# EAGLE design UnicersalRackcard (EAGLE 6.5.0)
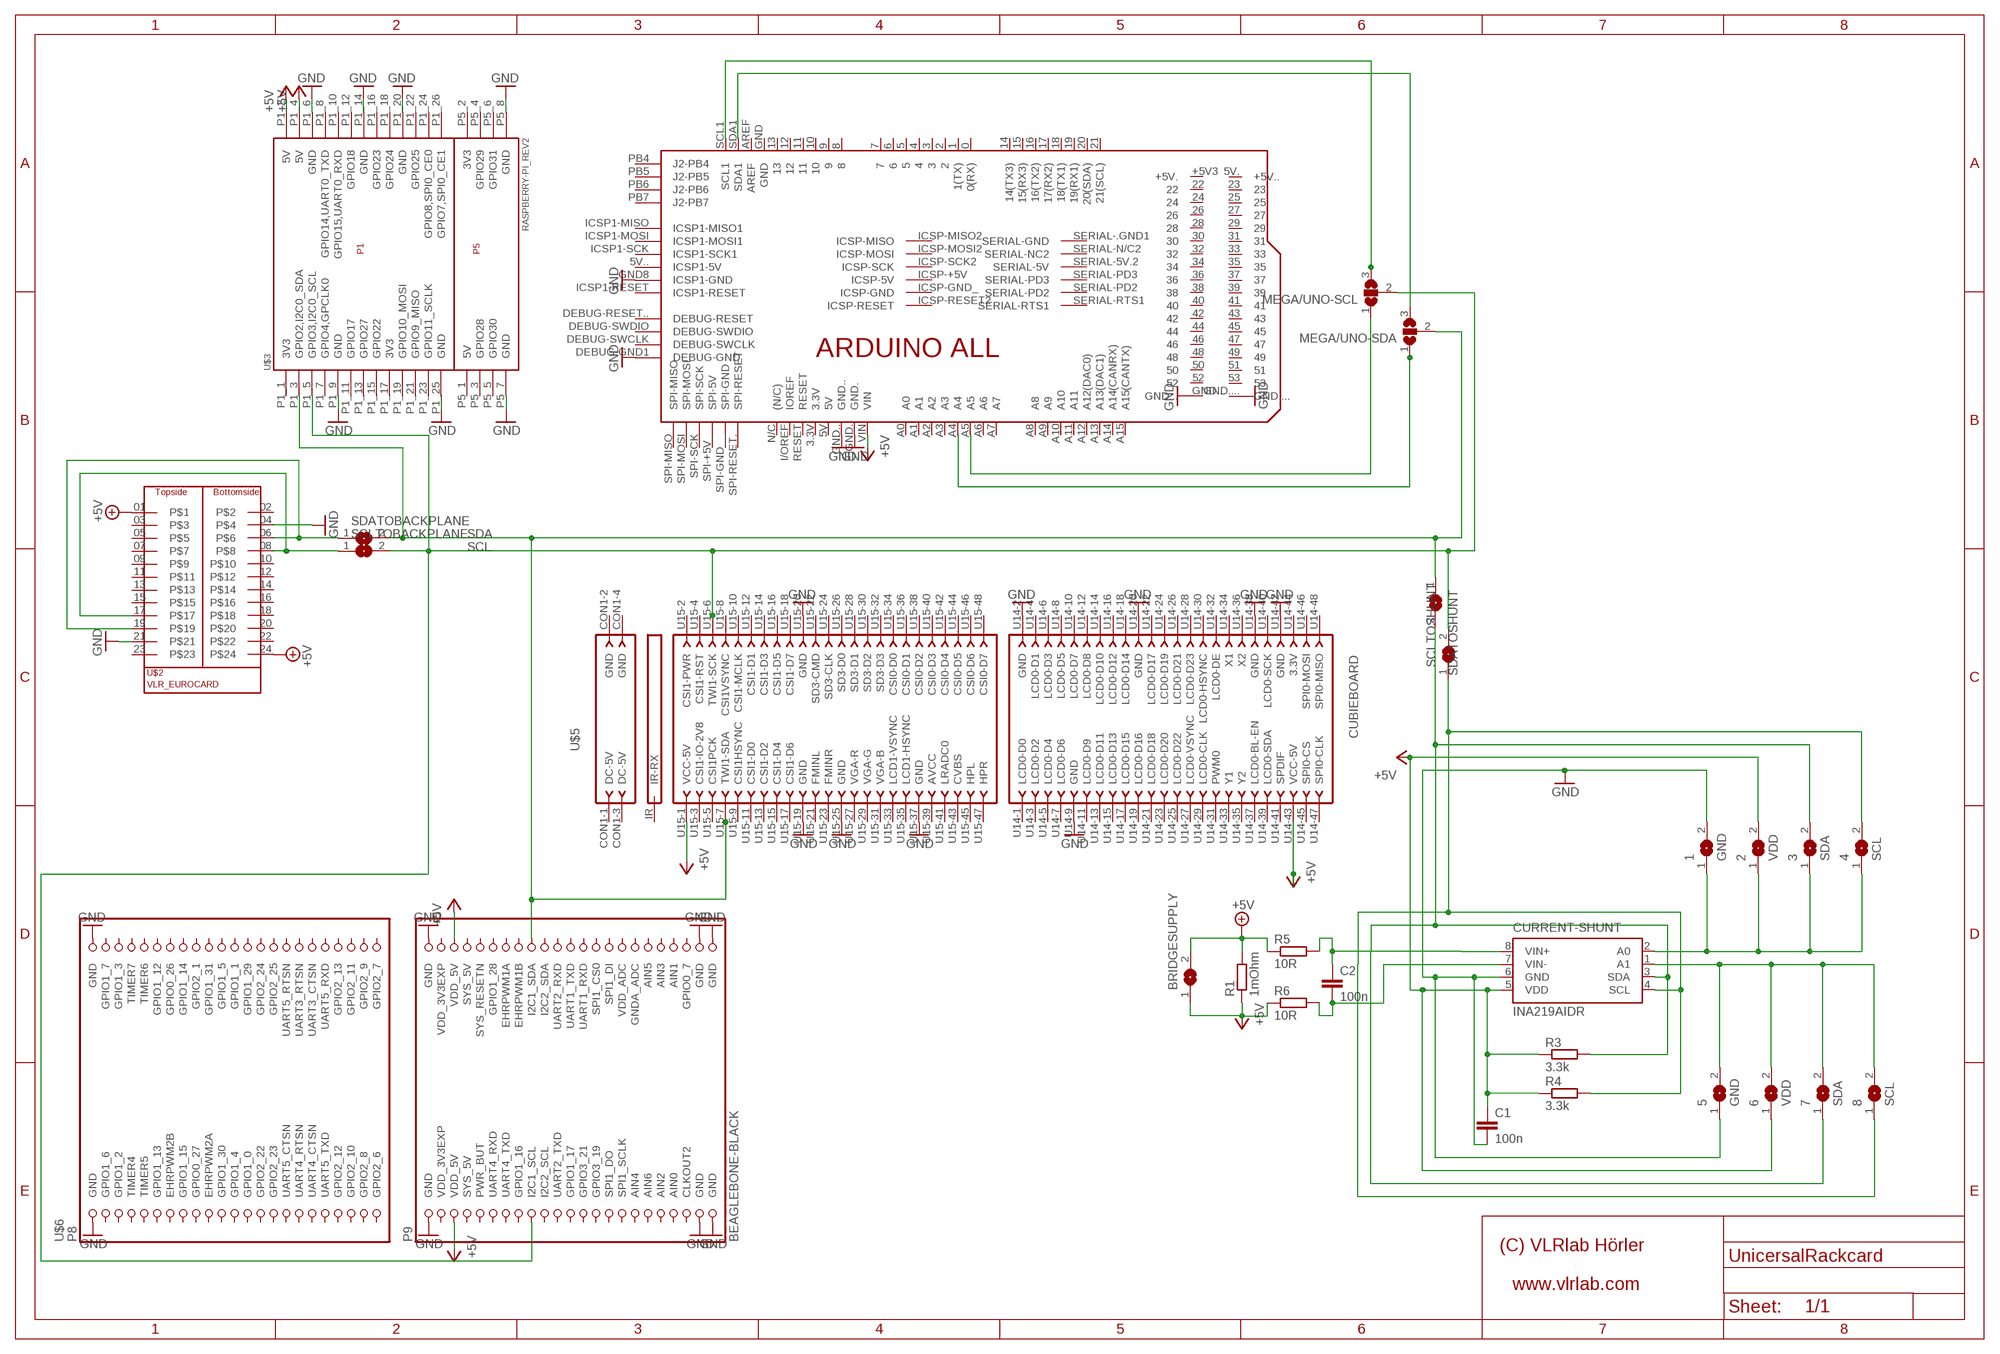
[diagram p0: schematic, sheet 1]

## Parts
1  GND  SJ  [SJ]
2  VDD  SJ  [SJ]
3  SDA  SJ  [SJ]
4  SCL  SJ  [SJ]
5  GND  SJ  [SJ]
6  VDD  SJ  [SJ]
7  SDA  SJ  [SJ]
8  SCL  SJ  [SJ]
BRIDGESUPPLY  SJW  [SJW]
C1  100n  C-EU025-024X044  [C025-024X044]
C2  100n  C-EU025-024X044  [C025-024X044]
CURRENT-SHUNT  INA219AIDR  [SO-08]
MEGA/UNO-SCL  SJ2W  [SJ_2]
MEGA/UNO-SDA  SJ2W  [SJ_2]
R1  1mOhm  R-EU_R2512  [R2512]
R3  3.3k  R-EU_0207/7  [0207/7]
R4  3.3k  R-EU_0207/7  [0207/7]
R5  10R  R-EU_0207/7  [0207/7]
R6  10R  R-EU_0207/7  [0207/7]
SCLTOBACKPLANE  SJ  [SJ]
SCLTOSHUNT  SJ  [SJ]
SDATOBACKPLANE  SJ  [SJ]
SDATOSHUNT  SJ  [SJ]
U$2  VLR_EUROCARD  [VLR_EUROCARD]
U$3  RASPBERRY-PI_REV2  [RASPBERRY-PI_REV2]
U$4  ARDUINO_ALL  [ALL]
U$5  CUBIEBOARD  [CUBIEBOARD]
U$6  BEAGLEBONE-BLACK  [BEAGLEBONE]

## Nets
+5V: 2.2 6.1 BRIDGESUPPLY.1 C1.1 CURRENT-SHUNT.5(VDD) R1.1 R3.1 R4.1 R6.1 U$3.P1_2(5V) U$3.P1_4(5V) U$4.VIN U$5.U14-43(VCC-5V) U$5.U15-1(VCC-5V) U$6.51(VDD_5V) U$6.52(VDD_5V)
A0: 1.1 2.1 3.1 4.1 CURRENT-SHUNT.2(A0)
A1: 5.2 6.2 7.2 8.2 CURRENT-SHUNT.1(A1)
GND: 1.2 5.1 C1.2 CURRENT-SHUNT.6(GND) U$2.04 U$2.21 U$3.P1_6(GND) U$3.P1_9(GND) U$3.P1_14(GND) U$3.P1_20(GND) U$3.P1_25(GND) U$3.P5_7(GND) U$3.P5_8(GND) U$4.DEBUG-GND1(DEBUG-GND) U$4.GND8(ICSP1-GND) U$4.GND. U$4.GND.. U$5.U14-2(GND) U$5.U14-9(GND) U$5.U14-20(GND) U$5.U14-38(GND) U$5.U14-42(GND) U$5.U15-19(GND) U$5.U15-20(GND) U$5.U15-25(GND) U$5.U15-37(GND) U$6.47(GND) U$6.48(GND) U$6.89(GND) U$6.90(GND) U$6.91(GND) U$6.92(GND) U$6.P8-1(GND) U$6.P8-2(GND)
N$1: MEGA/UNO-SDA.1 U$4.A4
N$2: MEGA/UNO-SCL.1 U$4.A5
N$3: MEGA/UNO-SCL.3 U$4.SCL1
N$4: MEGA/UNO-SDA.3 U$4.SDA1
N$5: 3.2 7.1 CURRENT-SHUNT.3(SDA) R3.2 SDATOSHUNT.2
N$6: 4.2 8.1 CURRENT-SHUNT.4(SCL) R4.2 SCLTOSHUNT.1
N$11: SDATOBACKPLANE.1 U$2.06 U$2.19
N$12: SCLTOBACKPLANE.1 U$2.08 U$2.17
PRIM+5V: BRIDGESUPPLY.2 R1.2 R5.1 U$2.01 U$2.24 ; supply symbol labelled +5V
SCL: MEGA/UNO-SCL.2 SCLTOBACKPLANE.2 SCLTOSHUNT.2 U$3.P1_5(GPIO3,I2C0_SCL) U$5.U15-6(TWI1-SCK) U$6.63(I2C1_SCL)
SDA: MEGA/UNO-SDA.2 SDATOBACKPLANE.2 SDATOSHUNT.1 U$3.P1_3(GPIO2,I2C0_SDA) U$5.U15-7(TWI1-SDA) U$6.64(I2C1_SDA)
VIN+: C2.1 CURRENT-SHUNT.8(VIN+) R5.2
VIN-: C2.2 CURRENT-SHUNT.7(VIN-) R6.2
Unconnected: U$2.02 U$2.03 U$2.05 U$2.07 U$2.09 U$2.10 U$2.11 U$2.12 U$2.13 U$2.14 U$2.15 U$2.16 U$2.18 U$2.20 U$2.22 U$2.23 U$3.P1_1(3V3) U$3.P1_7(GPIO4,GPCLK0) U$3.P1_8(GPIO14,UART0_TXD) U$3.P1_10(GPIO15,UART0_RXD) U$3.P1_11(GPIO17) U$3.P1_12(GPIO18) U$3.P1_13(GPIO27) U$3.P1_15(GPIO22) U$3.P1_16(GPIO23) U$3.P1_17(3V3) U$3.P1_18(GPIO24) U$3.P1_19(GPIO10_MOSI) U$3.P1_21(GPIO9_MISO) U$3.P1_22(GPIO25) U$3.P1_23(GPIO11_SCLK) U$3.P1_24(GPIO8,SPI0_CE0) U$3.P1_26(GPIO7,SPI0_CE1) U$3.P5_1(5V) U$3.P5_2(3V3) U$3.P5_3(GPIO28) U$3.P5_4(GPIO29) U$3.P5_5(GPIO30) U$3.P5_6(GPIO31) U$4.0(0(RX)) U$4.1(1(TX)) U$4.2 U$4.3 U$4.3.3V U$4.4 U$4.5 U$4.5V U$4.5V.(+5V..) U$4.5V..(ICSP1-5V) U$4.6 U$4.7 U$4.8 U$4.9 U$4.10 U$4.11 U$4.12 U$4.13 U$4.14(14(TX3)) U$4.15(15(RX3)) U$4.16(16(TX2)) U$4.17(17(RX2)) U$4.18(18(TX1)) U$4.19(19(RX1)) U$4.20(20(SDA)) U$4.21(21(SCL)) U$4.22 U$4.23 U$4.24 U$4.25 U$4.26 U$4.27 U$4.28 U$4.29 U$4.30 U$4.31 U$4.32 U$4.33 U$4.34 U$4.35 U$4.36 U$4.37 U$4.38 U$4.39 U$4.40 U$4.41 U$4.42 U$4.43 U$4.44 U$4.45 U$4.46 U$4.47 U$4.48 U$4.49 U$4.50 U$4.51 U$4.52 U$4.53 U$4.+5V3(+5V.) U$4.A0 U$4.A1 U$4.A2 U$4.A3 U$4.A6 U$4.A7 U$4.A8 U$4.A9 U$4.A10 U$4.A11 U$4.A12(A12(DAC0)) U$4.A13(A13(DAC1)) U$4.A14(A14(CANRX)) U$4.A15(A15(CANTX)) U$4.AREF U$4.DEBUG-RESET..(DEBUG-RESET) U$4.DEBUG-SWCLK U$4.DEBUG-SWDIO U$4.GND U$4.GND... U$4.GND.... U$4.I/OREF(IOREF) U$4.ICSP1-MISO(ICSP1-MISO1) U$4.ICSP1-MOSI(ICSP1-MOSI1) U$4.ICSP1-RESET U$4.ICSP1-SCK(ICSP1-SCK1) U$4.ICSP-+5V(ICSP-5V) U$4.ICSP-GND_(ICSP-GND) U$4.ICSP-MISO2(ICSP-MISO) U$4.ICSP-MOSI2(ICSP-MOSI) U$4.ICSP-RESET2(ICSP-RESET) U$4.ICSP-SCK2(ICSP-SCK) U$4.N/C((N/C)) U$4.PB4(J2-PB4) U$4.PB5(J2-PB5) U$4.PB6(J2-PB6) U$4.PB7(J2-PB7) U$4.RESET U$4.SERIAL-5V.2(SERIAL-5V) U$4.SERIAL-.GND1(SERIAL-GND) U$4.SERIAL-N/C2(SERIAL-NC2) U$4.SERIAL-PD2 U$4.SERIAL-PD3 U$4.SERIAL-RTS1 U$4.SPI-+5V_(SPI-5V) U$4.SPI-GND__(SPI-GND) U$4.SPI-MISO U$4.SPI-MOSI U$4.SPI-RESET.(SPI-RESET) U$4.SPI-SCK U$5.CON1-1(DC-5V) U$5.CON1-2(GND) U$5.CON1-3(DC-5V) U$5.CON1-4(GND) U$5.IR(IR-RX) U$5.U14-1(LCD0-D0) U$5.U14-3(LCD0-D2) U$5.U14-4(LCD0-D1) U$5.U14-5(LCD0-D4) U$5.U14-6(LCD0-D3) U$5.U14-7(LCD0-D6) U$5.U14-8(LCD0-D5) U$5.U14-10(LCD0-D7) U$5.U14-11(LCD0-D9) U$5.U14-12(LCD0-D8) U$5.U14-13(LCD0-D11) U$5.U14-14(LCD0-D10) U$5.U14-15(LCD0-D13) U$5.U14-16(LCD0-D12) U$5.U14-17(LCD0-D15) U$5.U14-18(LCD0-D14) U$5.U14-19(LCD0-D16) U$5.U14-21(LCD0-D18) U$5.U14-22(LCD0-D17) U$5.U14-23(LCD0-D20) U$5.U14-24(LCD0-D19) U$5.U14-25(LCD0-D22) U$5.U14-26(LCD0-D21) U$5.U14-27(LCD0-VSYNC) U$5.U14-28(LCD0-D23) U$5.U14-29(LCD0-CLK) U$5.U14-30(LCD0-HSYNC) U$5.U14-31(PWM0) U$5.U14-32(LCD0-DE) U$5.U14-33(Y1) U$5.U14-34(X1) U$5.U14-35(Y2) U$5.U14-36(X2) U$5.U14-37(LCD0-BL-EN) U$5.U14-39(LCD0-SDA) U$5.U14-40(LCD0-SCK) U$5.U14-41(SPDIF) U$5.U14-44(3.3V) U$5.U14-45(SPI0-CS) U$5.U14-46(SPI0-MOSI) U$5.U14-47(SPI0-CLK) U$5.U14-48(SPI0-MISO) U$5.U15-2(CSI1-PWR) U$5.U15-3(CSI1-IO-2V8) U$5.U15-4(CSI1-RST) U$5.U15-5(CSI1PCK) U$5.U15-8(CSI1VSYNC) U$5.U15-9(CSI1HSYNC) U$5.U15-10(CSI1-MCLK) U$5.U15-11(CSI1-D0) U$5.U15-12(CSI1-D1) U$5.U15-13(CSI1-D2) U$5.U15-14(CSI1-D3) U$5.U15-15(CSI1-D4) U$5.U15-16(CSI1-D5) U$5.U15-17(CSI1-D6) U$5.U15-18(CSI1-D7) U$5.U15-21(FMINL) U$5.U15-22(SD3-CMD) U$5.U15-23(FMINR) U$5.U15-24(SD3-CLK) U$5.U15-26(SD3-D0) U$5.U15-27(VGA-R) U$5.U15-28(SD3-D1) U$5.U15-29(VGA-G) U$5.U15-30(SD3-D2) U$5.U15-31(VGA-B) U$5.U15-32(SD3-D3) U$5.U15-33(LCD1-VSYNC) U$5.U15-34(CSI0-D0) U$5.U15-35(LCD1-HSYNC) U$5.U15-36(CSI0-D1) U$5.U15-38(CSI0-D2) U$5.U15-39(AVCC) U$5.U15-40(CSI0-D3) U$5.U15-41(LRADC0) U$5.U15-42(CSI0-D4) U$5.U15-43(CVBS) U$5.U15-44(CSI0-D5) U$5.U15-45(HPL) U$5.U15-46(CSI0-D6) U$5.U15-47(HPR) U$5.U15-48(CSI0-D7) U$6.54(SYS_5V) U$6.55(PWR_BUT) U$6.56(SYS_RESETN) U$6.57(UART4_RXD) U$6.58(GPIO1_28) U$6.59(UART4_TXD) U$6.60(EHRPWM1A) U$6.61(GPIO1_16) U$6.62(EHRPWM1B) U$6.65(I2C2_SCL) U$6.66(I2C2_SDA) U$6.67(UART2_TXD) U$6.68(UART2_RXD) U$6.69(GPIO1_17) U$6.70(UART1_TXD) U$6.71(GPIO3_21) U$6.72(UART1_RXD) U$6.73(GPIO3_19) U$6.74(SPI1_CS0) U$6.75(SPI1_DO) U$6.76(SPI1_DI) U$6.77(SPI1_SCLK) U$6.78(VDD_ADC) U$6.79(AIN4) U$6.80(GNDA_ADC) U$6.81(AIN6) U$6.82(AIN5) U$6.83(AIN2) U$6.84(AIN3) U$6.86(AIN1) U$6.87(CLKOUT2) U$6.88(GPIO0_7) U$6.P8-3(GPIO1_6) U$6.P8-4(GPIO1_7) U$6.P8-5(GPIO1_2) U$6.P8-6(GPIO1_3) U$6.P8-7(TIMER4) U$6.P8-8(TIMER7) U$6.P8-9(TIMER5) U$6.P8-10(TIMER6) U$6.P8-11(GPIO1_13) U$6.P8-12(GPIO1_12) U$6.P8-13(EHRPWM2B) U$6.P8-14(GPIO0_26) U$6.P8-15(GPIO1_15) U$6.P8-16(GPIO1_14) U$6.P8-17(GPIO0_27) U$6.P8-18(GPIO2_1) U$6.P8-19(EHRPWM2A) U$6.P8-20(GPIO1_31) U$6.P8-21(GPIO1_30) U$6.P8-22(GPIO1_5) U$6.P8-23(GPIO1_4) U$6.P8-24(GPIO1_1) U$6.P8-25(GPIO1_0) U$6.P8-26(GPIO1_29) U$6.P8-27(GPIO2_22) U$6.P8-28(GPIO2_24) U$6.P8-29(GPIO2_23) U$6.P8-30(GPIO2_25) U$6.P8-31(UART5_CTSN) U$6.P8-32(UART5_RTSN) U$6.P8-33(UART4_RTSN) U$6.P8-34(UART3_RTSN) U$6.P8-35(UART4_CTSN) U$6.P8-36(UART3_CTSN) U$6.P8-37(UART5_TXD) U$6.P8-38(UART5_RXD) U$6.P8-39(GPIO2_12) U$6.P8-40(GPIO2_13) U$6.P8-41(GPIO2_10) U$6.P8-42(GPIO2_11) U$6.P8-43(GPIO2_8) U$6.P8-44(GPIO2_9) U$6.P8-45(GPIO2_6) U$6.P8-46(GPIO2_7)

## Power pins joined to a net without a drawn wire
AIN0: U$6.85(AIN0)
SYS_5V: U$6.53(SYS_5V)
VDD_3V3EXP: U$6.49(VDD_3V3EXP) U$6.50(VDD_3V3EXP)

## Library data of the parts
1-8 BRIDGESUPPLY SCLTOBACKPLANE SCLTOSHUNT SDATOBACKPLANE SDATOSHUNT = jumper:SJ: SMD solder JUMPER
C1 C2 = rcl:C-EU: CAPACITOR, European symbol
CURRENT-SHUNT = texas:INA219AIDR
MEGA/UNO-SCL MEGA/UNO-SDA = jumper:SJ2W: SMD solder JUMPER
R1 = resistor:R-EU_: RESISTOR, European symbol
R3-R6 = rcl:R-EU_: RESISTOR, European symbol
U$2 = Frames_VLR:VLR_EUROCARD
U$3 = RaspberryPi:RASPBERRY-PI_REV2: Raspberry Pi Board <http://www.raspberrypi.org/> Jacques Lagnel V1.0 (beta) 2012 Mateusz Bawaj V1.1 (beta) 2012 Board dimension: Forum 3D model <http://www.raspberrypi.org/forum/general-discussion/mechanical-profile-3d-models?value=3d%20model&type=1&include=1&search=1&ret=all> The GPIO Connector (P1): http://elinux.org/RPi_Low-level_peripherals The GPIO Connector (P5): http://www.raspberrypi-spy.co.uk/2012/09/raspberry-pi-p5-header/
U$4 = Arduino:ARDUINO_ALL
U$5 = Cubie:CUBIEBOARD
U$6 = beaglebone:BEAGLEBONE-BLACK

## Board
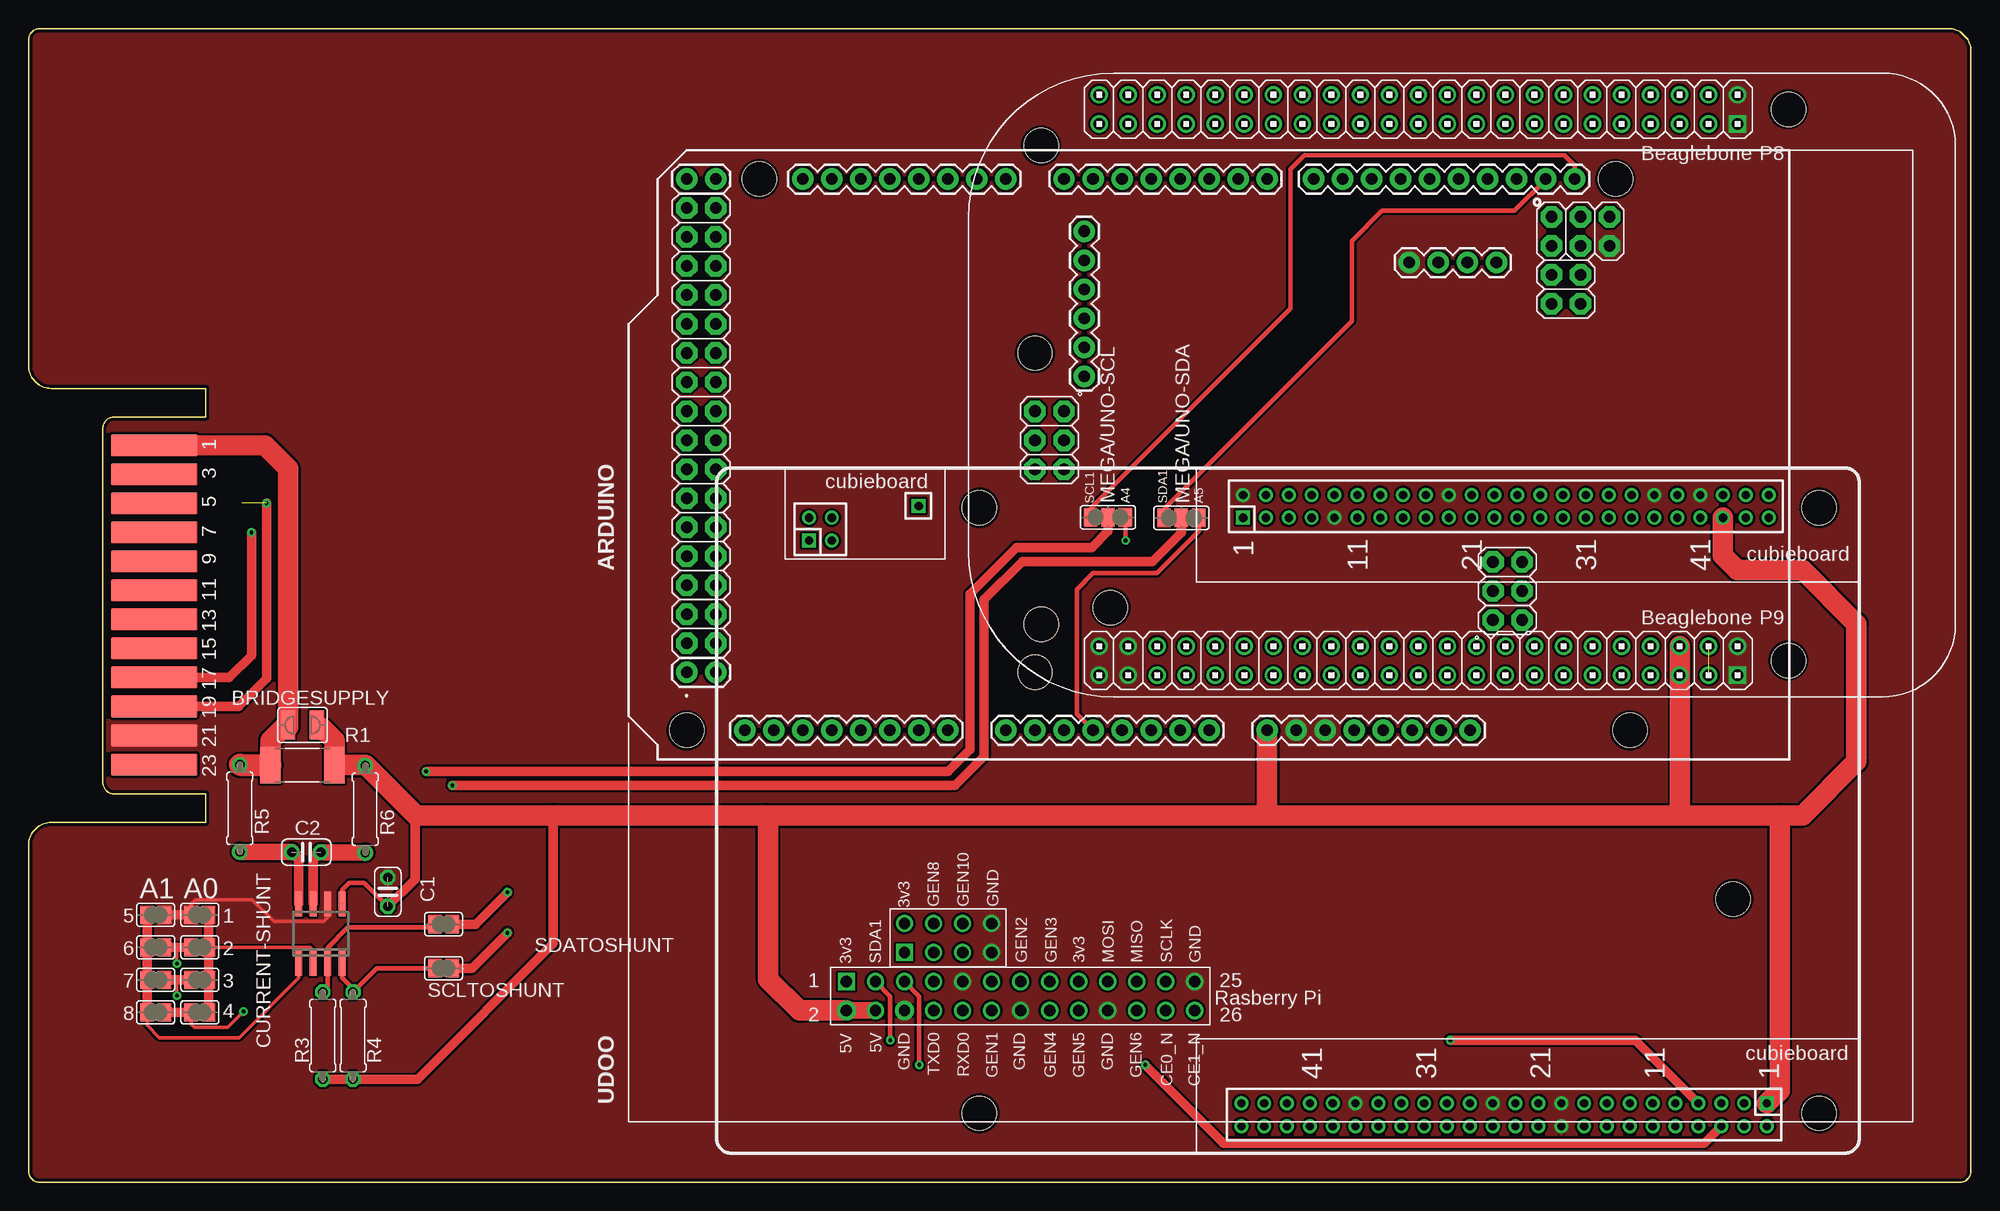
[diagram p1: board, top side]
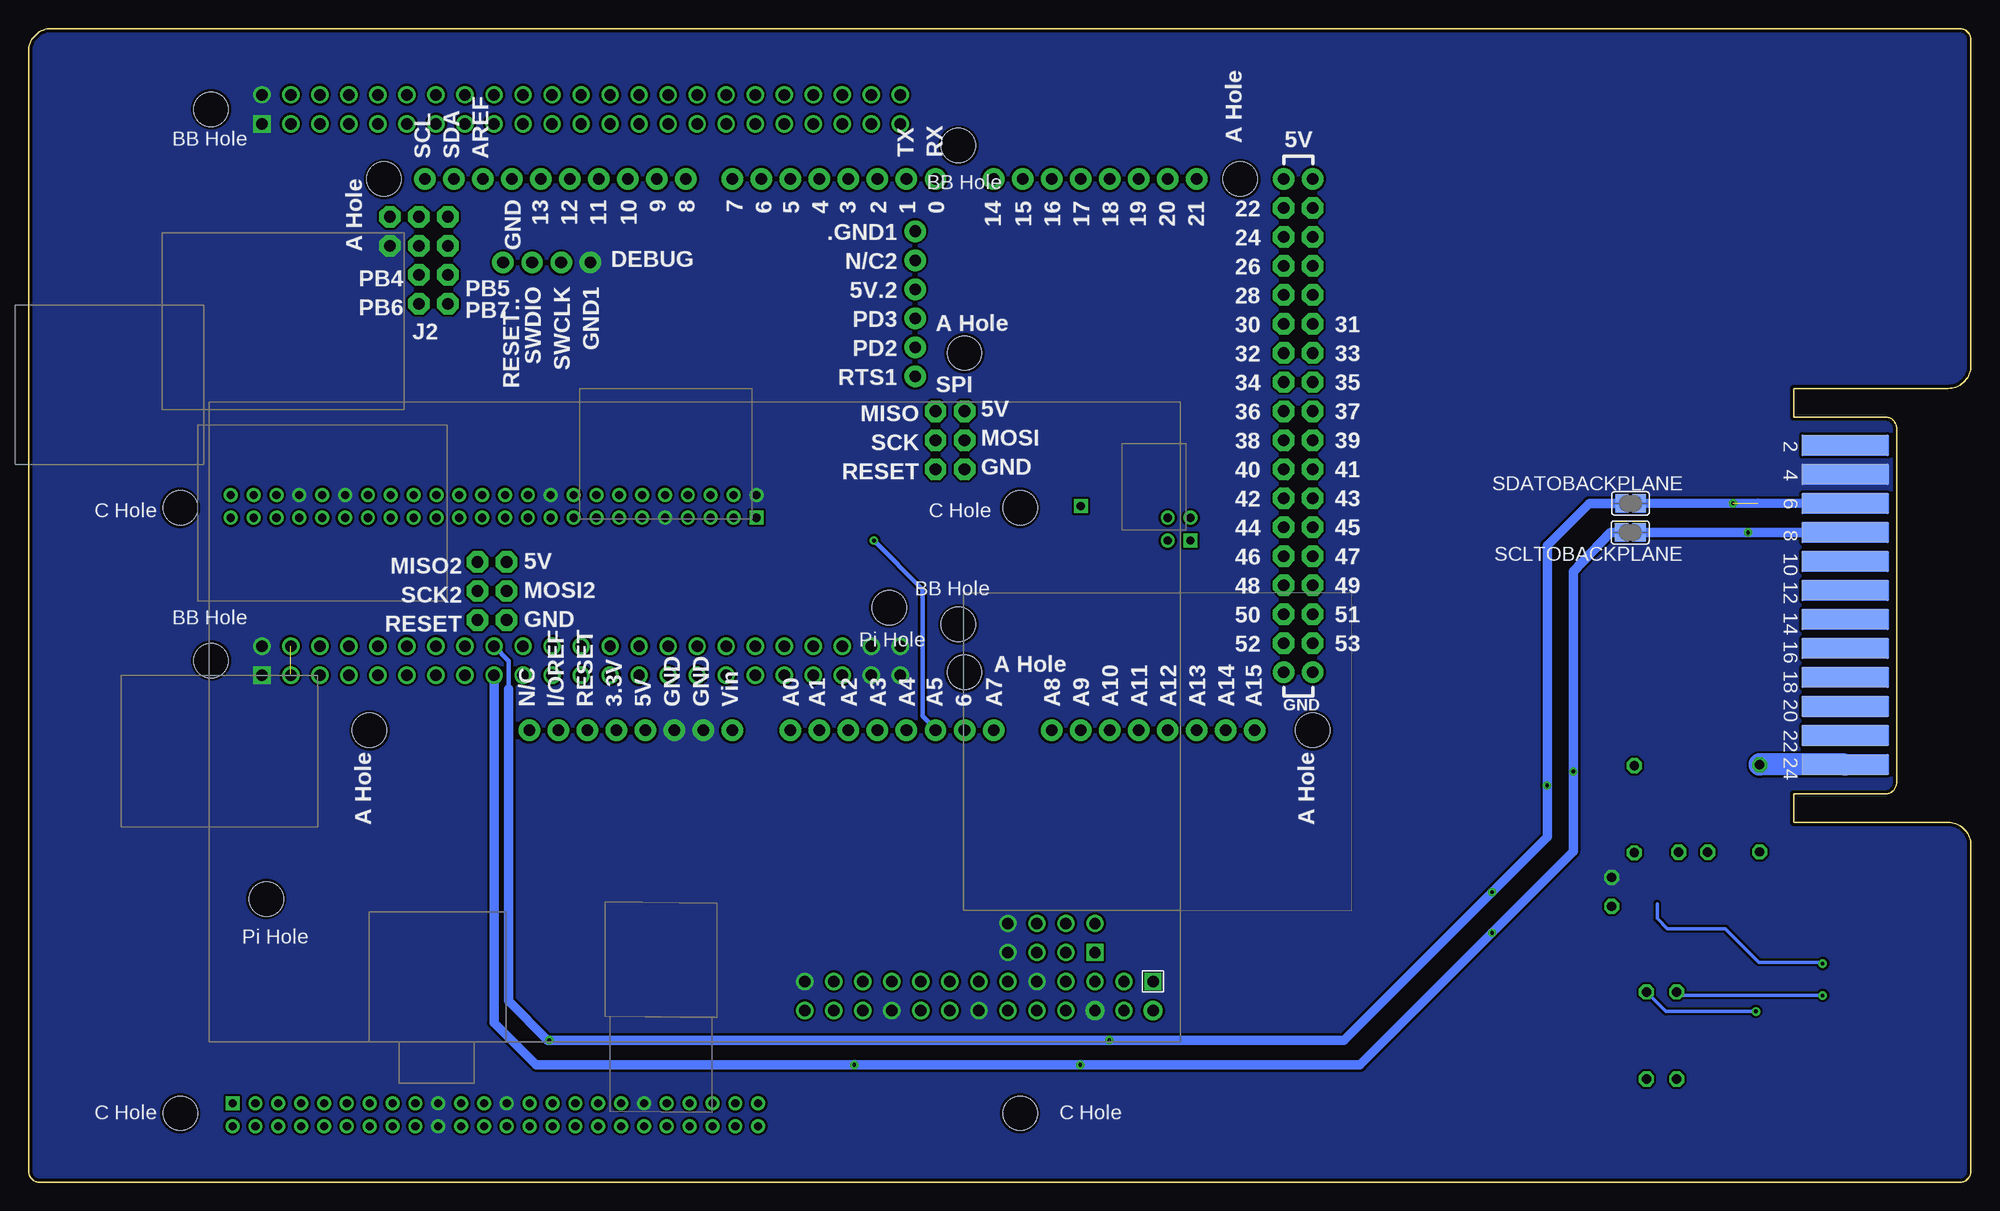
[diagram p2: board, bottom side, seen from below]

Size 170 x 101 mm. Coordinates in mm from the lower left corner, seen from the top.
Copper layers (1*16): Top 0.07mm / dielectric 1.6mm / Bottom 0.07mm
Design rules "default *": minimum track width 10mil, minimum drill 13mil, track to track 8mil, track to pad 8mil, pad to pad 8mil, via to via 8mil, smd to smd 8mil, copper to edge 10mil, drill to drill 8mil, minimum pad ring 10mil, minimum via ring 8mil, stop-mask expansion 4mil, vias tented up to drill 0mil, thermal gap 0mil

### Footprints (pad centres in the part's own frame; a part is rotated, then mirrored left to right if it is on the bottom)
SJ = smd 1.168 x 1.6: 1 -0.762,0; 2 0.762,0
SJW = smd 1.27 x 2.54: 1 -1.27,0; 2 1.27,0
C025-024X044 = drill 0.813 octagon: 1 -1.27,0; 2 1.27,0
SO-08 = smd 0.6 x 2.2: 1 -1.905,-2.6; 2 -0.635,-2.6; 3 0.635,-2.6; 4 1.905,-2.6; 5 1.905,2.6; 6 0.635,2.6; 7 -0.635,2.6; 8 -1.905,2.6
SJ_2 = smd 1.168 x 1.6: 1 -1.524,0; 2 0,0; 3 1.524,0
R2512 = smd 1.8 x 3.2: 1 -2.8,0; 2 2.8,0
0207/7 = drill 0.813 octagon: 1 -3.81,0; 2 3.81,0
VLR_EUROCARD = smd 7.62 x 1.9: 01 11,64.52; 03 11,61.98; 05 11,59.44; 07 11,56.9; 09 11,54.36; 11 11,51.82; 13 11,49.28; 15 11,46.74; 17 11,44.2; 19 11,41.66; 21 11,39.12; 23 11,36.58 | smd 7.62 x 1.9 bottom: 02 11.005,64.52; 04 11.005,61.98; 06 11.005,59.44; 08 11.005,56.9; 10 11.005,54.36; 12 11.005,51.82; 14 11.005,49.28; 16 11.005,46.74; 18 11.005,44.2; 20 11.005,41.66; 22 11.005,39.12; 24 11.005,36.58
RASPBERRY-PI_REV2 = drill 1 square: P1_1 -41.91,21.59; P5_1 -36.83,19.05 | drill 1 pad 1.676: P1_2 -41.91,24.13; P1_6 -36.83,24.13 | drill 1: P1_3 -39.37,21.59; P1_4 -39.37,24.13; P1_5 -36.83,21.59; P1_7 -34.29,21.59; P1_8 -34.29,24.13; P1_9 -31.75,21.59; P1_10 -31.75,24.13; P1_11 -29.21,21.59; P1_12 -29.21,24.13; P1_13 -26.67,21.59; P1_14 -26.67,24.13; P1_15 -24.13,21.59; P1_16 -24.13,24.13; P1_17 -21.59,21.59; P1_18 -21.59,24.13; P1_19 -19.05,21.59; P1_20 -19.05,24.13; P1_21 -16.51,21.59; P1_22 -16.51,24.13; P1_23 -13.97,21.59; P1_24 -13.97,24.13; P1_25 -11.43,21.59; P1_26 -11.43,24.13; P5_2 -36.83,16.51; P5_3 -34.29,19.05; P5_4 -34.29,16.51; P5_5 -31.75,19.05; P5_6 -31.75,16.51; P5_7 -29.21,19.05; P5_8 -29.21,16.51 | hole 3: 35.69,14.365; -18.81,-11.135
ALL = drill 1.016 pad 1.88: 0 63.5,50.8; 1 60.96,50.8; 2 58.42,50.8; 3 55.88,50.8; 3.3V 35.56,2.54; 4 53.34,50.8; 5 50.8,50.8; 5V 38.1,2.54; 5V. 93.98,50.8; 5V.. 96.52,50.8; 6 48.26,50.8; 7 45.72,50.8; 8 41.656,50.8; 9 39.116,50.8; 10 36.576,50.8; 11 34.036,50.8; 12 31.496,50.8; 13 28.956,50.8; 14 68.58,50.8; 15 71.12,50.8; 16 73.66,50.8; 17 76.2,50.8; 18 78.74,50.8; 19 81.28,50.8; 20 83.82,50.8; 21 86.36,50.8; A0 50.8,2.54; A1 53.34,2.54; A2 55.88,2.54; A3 58.42,2.54; A4 60.96,2.54; A5 63.5,2.54; A6 66.04,2.54; A7 68.58,2.54; A8 73.66,2.54; A9 76.2,2.54; A10 78.74,2.54; A11 81.28,2.54; A12 83.82,2.54; A13 86.36,2.54; A14 88.9,2.54; A15 91.44,2.54; AREF 23.876,50.8; DEBUG-GND1 33.274,43.485; DEBUG-RESET.. 25.654,43.485; DEBUG-SWCLK 30.734,43.485; DEBUG-SWDIO 28.194,43.485; GND 26.416,50.8; GND. 43.18,2.54; GND.. 40.64,2.54; GND... 93.98,7.62; GND.... 96.52,7.62; I/OREF 30.48,2.54; N/C 27.94,2.54; RESET 33.02,2.54; SCL1 18.796,50.8; SDA1 21.336,50.8; SERIAL-5V.2 61.722,41.148; SERIAL-.GND1 61.722,46.228; SERIAL-N/C2 61.722,43.688; SERIAL-PD2 61.722,36.068; SERIAL-PD3 61.722,38.608; SERIAL-RTS1 61.722,33.528; VIN 45.72,2.54 | drill 1.016 pad 1.88 octagon: 22 93.98,48.26; 23 96.52,48.26; 24 93.98,45.72; 25 96.52,45.72; 26 93.98,43.18; 27 96.52,43.18; 28 93.98,40.64; 29 96.52,40.64; 30 93.98,38.1; 31 96.52,38.1; 32 93.98,35.56; 33 96.52,35.56; 34 93.98,33.02; 35 96.52,33.02; 36 93.98,30.48; 37 96.52,30.48; 38 93.98,27.94; 39 96.52,27.94; 40 93.98,25.4; 41 96.52,25.4; 42 93.98,22.86; 43 96.52,22.86; 44 93.98,20.32; 45 96.52,20.32; 46 93.98,17.78; 47 96.52,17.78; 48 93.98,15.24; 49 96.52,15.24; 50 93.98,12.7; 51 96.52,12.7; 52 93.98,10.16; 53 96.52,10.16; +5V3 20.828,44.958; GND8 15.748,44.958; ICSP1-MISO 20.828,47.498; ICSP1-MOSI 18.288,44.958; ICSP1-RESET 15.748,47.498; ICSP1-SCK 18.288,47.498; ICSP-+5V 25.959,17.272; ICSP-GND_ 25.959,12.192; ICSP-MISO2 23.419,17.272; ICSP-MOSI2 25.959,14.732; ICSP-RESET2 23.419,12.192; ICSP-SCK2 23.419,14.732; PB4 18.288,42.418; PB5 20.828,42.418; PB6 18.288,39.878; PB7 20.828,39.878; SPI-+5V_ 66.04,30.48; SPI-GND__ 66.04,25.4; SPI-MISO 63.5,30.48; SPI-MOSI 66.04,27.94; SPI-RESET. 63.5,25.4; SPI-SCK 63.5,27.94 | hole 3: 15.24,50.8; 13.97,2.54; 66.04,35.56; 66.04,7.62; 90.17,50.8; 96.52,2.54
CUBIEBOARD = drill 0.711 square: CON1-1 24.63,47.92; IR 27.646,38.316; U14-1 26.63,9.92; U15-1 -24.63,-35.92 | drill 0.711: CON1-2 26.63,47.92; CON1-3 24.63,45.92; CON1-4 26.63,45.92; U14-2 28.63,9.92; U14-3 26.63,7.92; U14-4 28.63,7.92; U14-5 26.63,5.92; U14-6 28.63,5.92; U14-7 26.63,3.92; U14-8 28.63,3.92; U14-9 26.63,1.92; U14-10 28.63,1.92; U14-11 26.63,-0.08; U14-12 28.63,-0.08; U14-13 26.63,-2.08; U14-14 28.63,-2.08; U14-15 26.63,-4.08; U14-16 28.63,-4.08; U14-17 26.63,-6.08; U14-18 28.63,-6.08; U14-19 26.63,-8.08; U14-20 28.63,-8.08; U14-21 26.63,-10.08; U14-22 28.63,-10.08; U14-23 26.63,-12.08; U14-24 28.63,-12.08; U14-25 26.63,-14.08; U14-26 28.63,-14.08; U14-27 26.63,-16.08; U14-28 28.63,-16.08; U14-29 26.63,-18.08; U14-30 28.63,-18.08; U14-31 26.63,-20.08; U14-32 28.63,-20.08; U14-33 26.63,-22.08; U14-34 28.63,-22.08; U14-35 26.63,-24.08; U14-36 28.63,-24.08; U14-37 26.63,-26.08; U14-38 28.63,-26.08; U14-39 26.63,-28.08; U14-40 28.63,-28.08; U14-41 26.63,-30.08; U14-42 28.63,-30.08; U14-43 26.63,-32.08; U14-44 28.63,-32.08; U14-45 26.63,-34.08; U14-46 28.63,-34.08; U14-47 26.63,-36.08; U14-48 28.63,-36.08; U15-2 -26.63,-35.92; U15-3 -24.63,-33.92; U15-4 -26.63,-33.92; U15-5 -24.63,-31.92; U15-6 -26.63,-31.92; U15-7 -24.63,-29.92; U15-8 -26.63,-29.92; U15-9 -24.63,-27.92; U15-10 -26.63,-27.92; U15-11 -24.63,-25.92; U15-12 -26.63,-25.92; U15-13 -24.63,-23.92; U15-14 -26.63,-23.92; U15-15 -24.63,-21.92; U15-16 -26.63,-21.92; U15-17 -24.63,-19.92; U15-18 -26.63,-19.92; U15-19 -24.63,-17.92; U15-20 -26.63,-17.92; U15-21 -24.63,-15.92; U15-22 -26.63,-15.92; U15-23 -24.63,-13.92; U15-24 -26.63,-13.92; U15-25 -24.63,-11.92; U15-26 -26.63,-11.92; U15-27 -24.63,-9.92; U15-28 -26.63,-9.92; U15-29 -24.63,-7.92; U15-30 -26.63,-7.92; U15-31 -24.63,-5.92; U15-32 -26.63,-5.92; U15-33 -24.63,-3.92; U15-34 -26.63,-3.92; U15-35 -24.63,-1.92; U15-36 -26.63,-1.92; U15-37 -24.63,0.08; U15-38 -26.63,0.08; U15-39 -24.63,2.08; U15-40 -26.63,2.08; U15-41 -24.63,4.08; U15-42 -26.63,4.08; U15-43 -24.63,6.08; U15-44 -26.63,6.08; U15-45 -24.63,8.08; U15-46 -26.63,8.08; U15-47 -24.63,10.08; U15-48 -26.63,10.08 | hole 3: -25.5,-40.5; 27.5,-40.5; -25.5,33; 27.5,33
BEAGLEBONE = drill 1 square: 47 52.705,19.05; P8-1 4.445,19.05 | drill 1: 48 50.165,19.05; 49 52.705,21.59; 50 50.165,21.59; 51 52.705,24.13; 52 50.165,24.13; 53 52.705,26.67; 54 50.165,26.67; 55 52.705,29.21; 56 50.165,29.21; 57 52.705,31.75; 58 50.165,31.75; 59 52.705,34.29; 60 50.165,34.29; 61 52.705,36.83; 62 50.165,36.83; 63 52.705,39.37; 64 50.165,39.37; 65 52.705,41.91; 66 50.165,41.91; 67 52.705,44.45; 68 50.165,44.45; 69 52.705,46.99; 70 50.165,46.99; 71 52.705,49.53; 72 50.165,49.53; 73 52.705,52.07; 74 50.165,52.07; 75 52.705,54.61; 76 50.165,54.61; 77 52.705,57.15; 78 50.165,57.15; 79 52.705,59.69; 80 50.165,59.69; 81 52.705,62.23; 82 50.165,62.23; 83 52.705,64.77; 84 50.165,64.77; 85 52.705,67.31; 86 50.165,67.31; 87 52.705,69.85; 88 50.165,69.85; 89 52.705,72.39; 90 50.165,72.39; 91 52.705,74.93; 92 50.165,74.93; P8-2 1.905,19.05; P8-3 4.445,21.59; P8-4 1.905,21.59; P8-5 4.445,24.13; P8-6 1.905,24.13; P8-7 4.445,26.67; P8-8 1.905,26.67; P8-9 4.445,29.21; P8-10 1.905,29.21; P8-11 4.445,31.75; P8-12 1.905,31.75; P8-13 4.445,34.29; P8-14 1.905,34.29; P8-15 4.445,36.83; P8-16 1.905,36.83; P8-17 4.445,39.37; P8-18 1.905,39.37; P8-19 4.445,41.91; P8-20 1.905,41.91; P8-21 4.445,44.45; P8-22 1.905,44.45; P8-23 4.445,46.99; P8-24 1.905,46.99; P8-25 4.445,49.53; P8-26 1.905,49.53; P8-27 4.445,52.07; P8-28 1.905,52.07; P8-29 4.445,54.61; P8-30 1.905,54.61; P8-31 4.445,57.15; P8-32 1.905,57.15; P8-33 4.445,59.69; P8-34 1.905,59.69; P8-35 4.445,62.23; P8-36 1.905,62.23; P8-37 4.445,64.77; P8-38 1.905,64.77; P8-39 4.445,67.31; P8-40 1.905,67.31; P8-41 4.445,69.85; P8-42 1.905,69.85; P8-43 4.445,72.39; P8-44 1.905,72.39; P8-45 4.445,74.93; P8-46 1.905,74.93 | hole 3: 3.175,14.605; 51.435,14.605; 6.35,80.01; 48.26,80.01

### Placement (x,y rotation side)
1  14.99,23.42 180 top
2  14.99,20.57 180 top
3  14.99,17.73 180 top
4  14.99,14.88 180 top
5  11.13,23.42 180 top
6  11.13,20.57 180 top
7  11.13,17.73 180 top
8  11.13,14.88 180 top
BRIDGESUPPLY  23.98,40.03 180 top
C1  31.45,25.43 90 top
C2  24.31,28.91 0 top
CURRENT-SHUNT  25.55,21.79 0 top
MEGA/UNO-SCL  94.47,58.22 180 top
MEGA/UNO-SDA  100.9,58.17 180 top
R1  23.98,36.53 180 top
R3  25.76,12.85 90 top
R4  28.4,12.85 90 top
R5  18.49,32.74 270 top
R6  29.46,32.66 270 top
SCLTOBACKPLANE  29.82,56.9 180 bottom
SCLTOSHUNT  36.32,18.75 0 top
SDATOBACKPLANE  29.79,59.44 180 bottom
SDATOSHUNT  36.32,22.61 180 top
U$2  0,0 0 top
U$3  113.5,39.17 180 bottom
U$4  154.12,37.03 0 bottom
U$5  116.22,31.55 90 top
U$6  168.63,97.1 270 bottom

### Tracks (layer width: path | path; a pad name or v marks a point on that pad's centre or on a via)
+5V  (via drill 0.33)  (1 unrouted)
  Top 0.305: 2.2 12.98,20.6 v12.98,19.15 | R3.1 R4.1
  Top 0.406: C1.1 31.42,24.16 29.36,26.21 28.04,26.21 27.43,25.6 27.43,24.42 CURRENT-SHUNT.5
  Top 0.813: 6.1 2.2 | 33.91,32.13 33.4,32.13 33.83,32.11 33.83,26.54 C1.1 | R3.1 34.04,9.04 45.92,20.93 45.92,32.13
  Top 1.016: 25.68,39.78 25.55,39.19 BRIDGESUPPLY.1
  Top 1.422: U$3.P1_2 U$3.P1_4
  Top 1.778: R1.1 26.78,38.68 25.68,39.78 | R1.1 29.52,36.52 | 29.52,36.52 R6.1 | R1.1 29.52,36.52 | 29.52,36.52 33.91,32.13 45.92,32.13 64.48,32.13 | 64.48,32.13 108.3,32.13 | 108.3,32.13 144.49,32.13 | 144.49,32.13 153.26,32.13 | 153.26,32.13 155.29,32.13 159.99,36.83 159.99,48.9 155.29,53.59 149.57,53.59 148.3,54.86 U$5.U14-43 | 144.49,32.13 144.5,32.14 U$6.51 U$6.52 | U$4.VIN 108.4,32.23 108.3,32.13 | U$3.P1_2 67.47,15.04 64.74,17.78 64.74,31.88 64.48,32.13 | U$5.U15-1 153.26,8.03 153.26,32.13
  Bottom 0.305: v12.98,19.15 13.11,19.28 18.31,19.28 18.57,19.28 21.49,22.2 26.57,22.2 27.46,23.09 CURRENT-SHUNT.5
A0
  Top 0.305: 2.1 24.64,20.57 24.92,20.3 CURRENT-SHUNT.2
  Top 0.813: 1.1 2.1 3.1 4.1
A1
  Top 0.305: 8.2 10.36,13.77 11.46,12.68 18.44,12.68 23.65,17.88 CURRENT-SHUNT.1
  Top 0.813: 5.2 6.2 7.2 8.2
GND
  Top 0.305: 1.2 14.22,24.33 14.63,24.74 19.58,24.74 21.49,22.84 25.81,22.84 26.19,23.22 CURRENT-SHUNT.6
  Top 0.813: 5.1 1.2
  pour Top: 0,100.99 0,0 169.51,0 170.12,0.61 170.12,99.57 169.51,100.99
  pour Bottom: 0,100.99 0,0 169.51,0 170.12,0.61 170.12,99.57 169.51,100.99
N$1
  Top 0.406: MEGA/UNO-SDA.1 102.42,57.01 98.75,53.34 93.17,53.34 91.75,51.92 91.75,40.99 U$4.A4
N$2  (via drill 0.33)
  Top 0.406: MEGA/UNO-SCL.1 arc-90 96.01,58.2 v96.01,56.19
  Bottom 0.406: v96.01,56.19 91.75,51.92 91.75,40.84 90.62,39.72 U$4.A5
N$3
  Top 0.406: MEGA/UNO-SCL.3 92.96,58.23 92.96,59.03 110.44,76.5 110.44,88.7 111.66,89.92 134.42,89.92 135.32,89.01 U$4.SCL1
N$4
  Top 0.406: MEGA/UNO-SDA.3 99.36,58.93 115.82,75.39 115.82,82.4 118.47,85.04 130.05,85.04 132.78,87.78 U$4.SDA1
N$5  (via drill 0.33)
  Top 0.305: 3.2 12.95,17.73 v12.98,16.36
  Top 0.406: SDATOSHUNT.2 35.56,22.58 35.28,22.3 27.94,22.3 26.19,20.55 CURRENT-SHUNT.3 26.19,17.09 R3.2
  Top 0.813: 7.1 12.95,17.73 3.2
  Bottom 0.305: v12.98,16.36 25.45,16.36 R3.2
N$6  (via drill 0.33)
  Top 0.305: 4.2 14.22,13.84 14.25,13.82 14.5,13.56 17.42,13.56 v18.82,14.96 | R4.2 28.4,16.94
  Top 0.406: 28.4,16.94 27.46,17.88 CURRENT-SHUNT.4 | R4.2 30.48,18.75 SCLTOSHUNT.1
  Top 0.813: 8.1 4.2
  Bottom 0.305: v18.82,14.96 26.7,14.96 R4.2
N$7
  Top 1.016: 22.23,39.37 22.73,39.75
N$11  (via drill 0.33)  (1 unrouted)
  Top 0.813: U$2.19 | U$2.19 15.04,41.66 | U$2.19 15.04,41.66 | 15.04,41.66 18.39,41.66 20.83,44.09 v20.83,59.44 v20.83,59.45
  Bottom 0.813: U$2.06 18.63,59.45 SDATOBACKPLANE.1
N$12  (via drill 0.33)
  Top 0.813: U$2.17 14.94,44.2 17.58,44.2 19.51,46.13 v19.51,56.9
  Bottom 0.813: SCLTOBACKPLANE.1 v19.51,56.9 U$2.08
PRIM+5V
  Top 1.016: 22.84,39.88 BRIDGESUPPLY.2
  Top 1.27: 22.35,39.88 22.73,39.88 22.84,39.88
  Top 1.778: R1.2 21.18,36.55 21.18,38.7 22.35,39.88 22.73,39.88 22.73,62.48 20.71,64.5 U$2.01
  Top 1.93: R5.1 21.18,36.55 R1.2
  Bottom 1.93: U$2.24 18.49,36.59 R5.1
SCL  (via drill 0.33)  (2 unrouted)
  Top 0.406: U$3.P1_5 77.94,16.31 v77.94,10.29
  Top 0.813: SCLTOSHUNT.2 38.81,18.75 v41.91,21.84 | U$5.U15-6 146.65,3.43 104.59,3.43 97.76,10.26 97.76,10.29 | v34.8,35.97 80.47,35.97 82.4,37.9 82.4,51.51 86.46,55.58 93.07,55.58 94.49,57 94.49,58.2 MEGA/UNO-SCL.2
  Bottom 0.813: SCLTOBACKPLANE.2 31.57,56.9 34.8,53.47 v34.8,35.97 34.8,28.96 v41.91,21.84 53.47,10.29 v77.95,10.29 v97.74,10.29 125.57,10.29 129.26,13.98 U$6.63
SDA  (via drill 0.33)  (1 unrouted)
  Top 0.406: U$3.P1_3 75.41,16.31 v75.41,12.45
  Top 0.813: SDATOSHUNT.1 39.12,22.61 v41.91,25.4 | U$5.U15-7 140.62,12.45 v124.44,12.45 v124.43,12.45 | v37.08,34.75 81.08,34.75 83.62,37.29 83.62,51 86.97,54.36 98.35,54.36 100.89,56.9 100.89,58.16 MEGA/UNO-SDA.2
  Bottom 0.406: U$6.64 127.98,45.66 127.98,43.18
  Bottom 0.813: SDATOBACKPLANE.2 33.4,59.44 37.08,55.75 v37.08,34.75 37.08,30.23 v41.91,25.4 54.86,12.45 v75.41,12.45 v124.44,12.45 124.55,12.45 127.98,15.88 127.98,43.18 | 74.14,17.59 U$3.P1_3
VDD_3V3EXP  (1 unrouted)
VIN+
  Top 0.813: C2.1 23.65,28.32 CURRENT-SHUNT.8
  Top 1.422: R5.2 23.04,28.93 C2.1
VIN-
  Top 0.813: C2.2 24.92,28.27 CURRENT-SHUNT.7
  Top 1.422: C2.2 28.14,28.91 R6.2

### Text on the board
tPlace: A1 | A0
tNames: SCL1 | A4 | SDA1 | A5